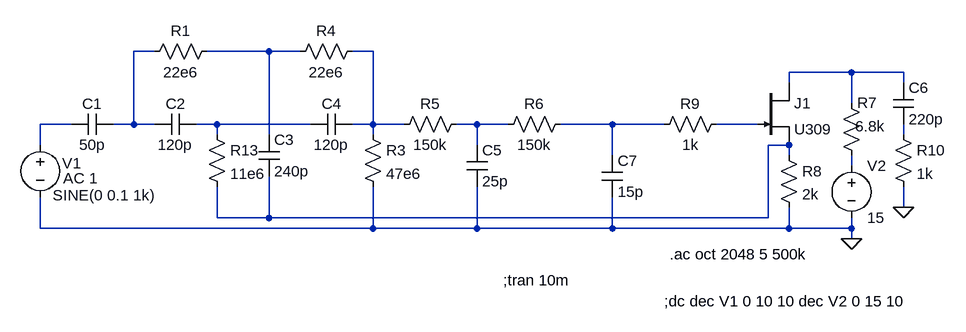
[diagram p0: schematic WhistlerWaveAmplifier.asc]
WhistlerWaveAmplifier.asc, the LTspice schematic file:
Version 4
SHEET 1 1256 680
WIRE 32 -32 0 -32
WIRE 208 -32 112 -32
WIRE 256 -32 208 -32
WIRE 368 -32 336 -32
WIRE 1104 0 1008 0
WIRE 1184 0 1104 0
WIRE 1008 16 1008 0
WIRE 1184 16 1184 0
WIRE 1104 48 1104 0
WIRE -96 80 -144 80
WIRE 0 80 0 -32
WIRE 0 80 -32 80
WIRE 32 80 0 80
WIRE 128 80 96 80
WIRE 272 80 128 80
WIRE 368 80 368 -32
WIRE 368 80 336 80
WIRE 416 80 368 80
WIRE 528 80 496 80
WIRE 576 80 528 80
WIRE 736 80 656 80
WIRE 816 80 736 80
WIRE 960 80 896 80
WIRE 128 96 128 80
WIRE 208 96 208 -32
WIRE 368 96 368 80
WIRE 1184 96 1184 80
WIRE -144 112 -144 80
WIRE 528 112 528 80
WIRE 1008 112 976 112
WIRE 736 128 736 80
WIRE 1008 128 1008 112
WIRE 1104 144 1104 128
WIRE 1184 208 1184 176
WIRE 128 224 128 176
WIRE 208 224 208 160
WIRE 208 224 128 224
WIRE 976 224 976 112
WIRE 976 224 208 224
WIRE -144 240 -144 192
WIRE 368 240 368 176
WIRE 368 240 -144 240
WIRE 528 240 528 176
WIRE 528 240 368 240
WIRE 736 240 736 192
WIRE 736 240 528 240
WIRE 1008 240 1008 208
WIRE 1008 240 736 240
WIRE 1104 240 1104 224
WIRE 1104 240 1008 240
WIRE 1104 256 1104 240
FLAG 1104 256 0
FLAG 1184 208 0
SYMBOL voltage -144 96 R0
WINDOW 3 19 93 Left 2
WINDOW 123 35 67 Left 2
WINDOW 39 0 0 Left 0
WINDOW 0 34 44 Left 2
SYMATTR Value SINE(0 0.1 1k)
SYMATTR Value2 AC 1
SYMATTR InstName V1
SYMBOL cap -32 64 R90
WINDOW 0 0 32 VBottom 2
WINDOW 3 32 32 VTop 2
SYMATTR InstName C1
SYMATTR Value 50p
SYMBOL cap 96 64 R90
WINDOW 0 0 32 VBottom 2
WINDOW 3 32 32 VTop 2
SYMATTR InstName C2
SYMATTR Value 120p
SYMBOL res 128 -48 R90
WINDOW 0 0 56 VBottom 2
WINDOW 3 32 56 VTop 2
SYMATTR InstName R1
SYMATTR Value 22e6
SYMBOL res 112 80 R0
SYMATTR InstName R13
SYMATTR Value 11e6
SYMBOL cap 192 96 R0
SYMATTR InstName C3
SYMATTR Value 240p
SYMBOL cap 336 64 R90
WINDOW 0 0 32 VBottom 2
WINDOW 3 32 32 VTop 2
SYMATTR InstName C4
SYMATTR Value 120p
SYMBOL res 352 80 R0
SYMATTR InstName R3
SYMATTR Value 47e6
SYMBOL res 352 -48 R90
WINDOW 0 0 56 VBottom 2
WINDOW 3 32 56 VTop 2
SYMATTR InstName R4
SYMATTR Value 22e6
SYMBOL njf 960 16 R0
SYMATTR InstName J1
SYMATTR Value U309
SYMBOL res 1088 32 R0
WINDOW 0 25 15 Left 2
WINDOW 3 22 51 Left 2
SYMATTR InstName R7
SYMATTR Value 6.8k
SYMBOL voltage 1104 128 R0
WINDOW 123 0 0 Left 0
WINDOW 39 0 0 Left 0
SYMATTR InstName V2
SYMATTR Value 15
SYMBOL res 992 112 R0
SYMATTR InstName R8
SYMATTR Value 2k
SYMBOL cap 1168 16 R0
SYMATTR InstName C6
SYMATTR Value 220p
SYMBOL res 512 64 R90
WINDOW 0 0 56 VBottom 2
WINDOW 3 32 56 VTop 2
SYMATTR InstName R5
SYMATTR Value 150k
SYMBOL res 672 64 R90
WINDOW 0 0 56 VBottom 2
WINDOW 3 32 56 VTop 2
SYMATTR InstName R6
SYMATTR Value 150k
SYMBOL res 912 64 R90
WINDOW 0 0 56 VBottom 2
WINDOW 3 32 56 VTop 2
SYMATTR InstName R9
SYMATTR Value 1k
SYMBOL cap 512 112 R0
SYMATTR InstName C5
SYMATTR Value 25p
SYMBOL cap 720 128 R0
SYMATTR InstName C7
SYMATTR Value 15p
SYMBOL res 1168 80 R0
SYMATTR InstName R10
SYMATTR Value 1k
TEXT 824 280 Left 2 !.ac oct 2048 5 500k
TEXT 816 352 Left 2 !;dc dec V1 0 10 10 dec V2 0 15 10
TEXT 568 320 Left 2 !;tran 10m

The netlist it stands for:
* WhistlerWaveAmplifier.asc
V1 N005 0 SINE(0 0.1 1k) AC 1
C1 N001 N005 50p
C2 N006 N001 120p
R1 N002 N001 22e6
R13 N006 N011 11e6
C3 N002 N011 240p
C4 N003 N006 120p
R3 N003 0 47e6
R4 N003 N002 22e6
J1 N004 N009 N011 U309
R7 N004 N012 6.8k
V2 N012 0 15
R8 N011 0 2k
C6 N004 N010 220p
R5 N007 N003 150k
R6 N008 N007 150k
R9 N009 N008 1k
C5 N007 0 25p
C7 N008 0 15p
R10 N010 0 1k
.model NJF NJF
.model PJF PJF
.lib standard.jft
.ac oct 2048 5 500k
;dc dec V1 0 10 10 dec V2 0 15 10
;tran 10m
.backanno
.end